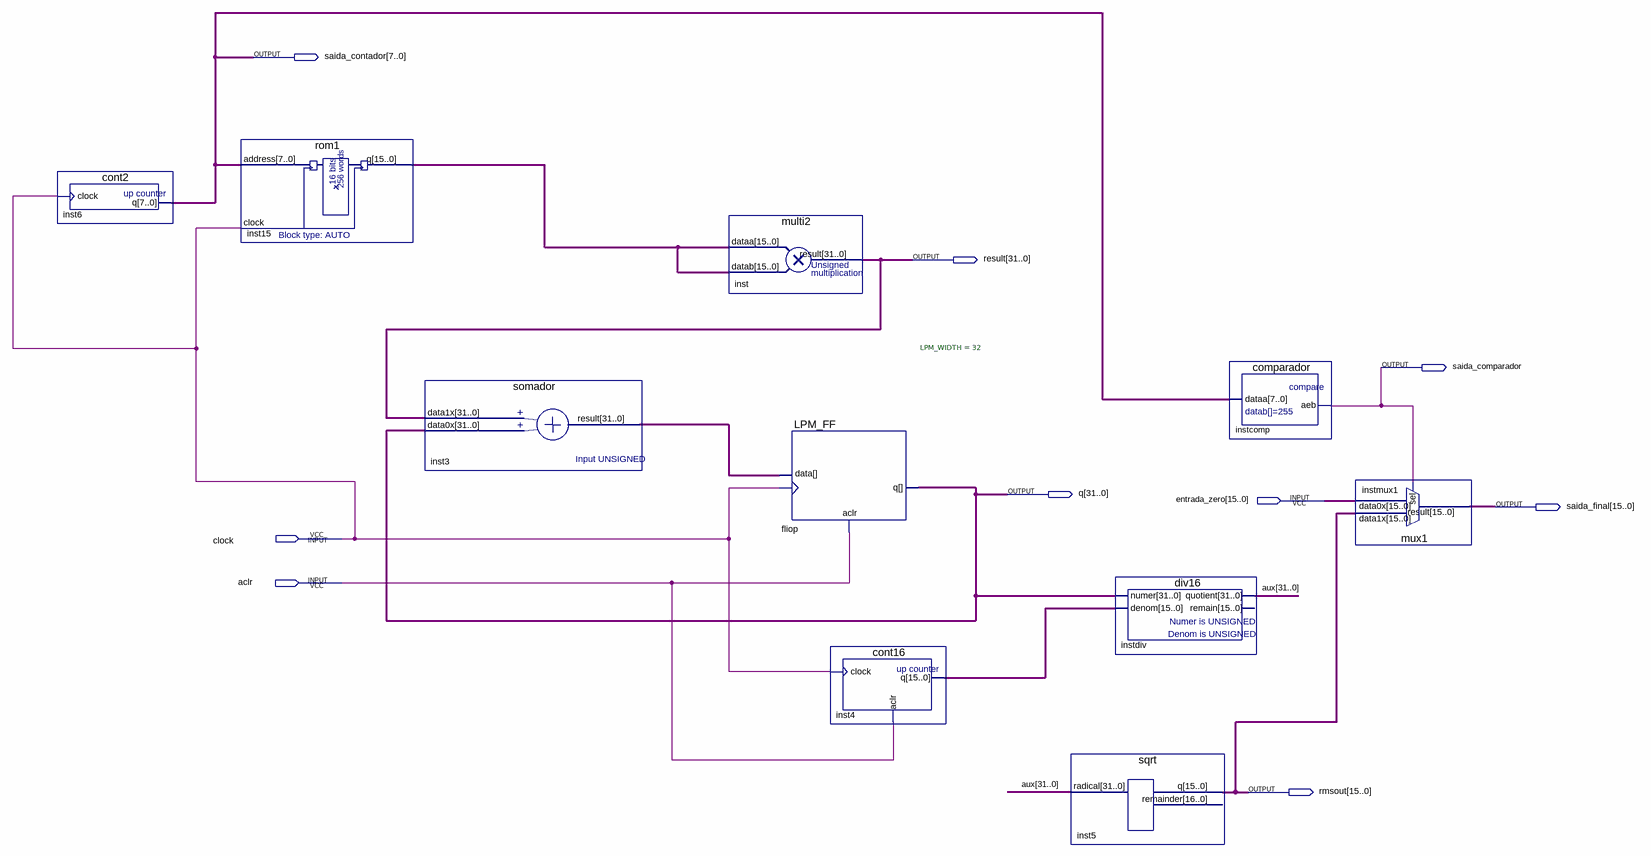
[diagram p0: schematic sheet]
// Quartus schematic rms.bdf as structural Verilog: 10 symbols, 9 pins
module rms (
  input  [15:0] entrada_zero,
  input  clock,
  input  aclr,
  output [7:0] saida_contador,
  output [31:0] result,
  output saida_comparador,
  output [31:0] q,
  output [15:0] saida_final,
  output [15:0] rmsout
);

  wire [15:0] inst4_q, inst15_q;
  wire [31:0] aux, inst3_result;

  cont2 inst6 (.clock(clock), .q(saida_contador));
  rom1 inst15 (.address(saida_contador), .clock(clock), .q(inst15_q));
  somador inst3 (.data1x(result), .data0x(q), .result(inst3_result));
  multi2 inst (.dataa(inst15_q), .datab(inst15_q), .result(result));
  LPM_FF #(.LPM_WIDTH(32)) fliop (.aclr(aclr), .clock(clock), .data(inst3_result), .q(q));
  cont16 inst4 (.clock(clock), .aclr(aclr), .q(inst4_q));
  sqrt inst5 (.radical(aux), .q(rmsout));  // open: remainder
  div16 instdiv (.numer(q), .denom(inst4_q), .quotient(aux));  // open: remain
  comparador instcomp (.dataa(saida_contador), .aeb(saida_comparador));
  mux1 instmux1 (.data1x(rmsout), .data0x(entrada_zero), .sel(saida_comparador), .result(saida_final));
endmodule
